# Altium schematic sheet Digital_Output_CPU.SchDoc: TTL IO Interface for External I/O
size Tabloid; Date: 03/13/2023; Engineer: Terry D. Schevker; Revision: 1,0; SheetNumber: 2; SheetTotal: 3
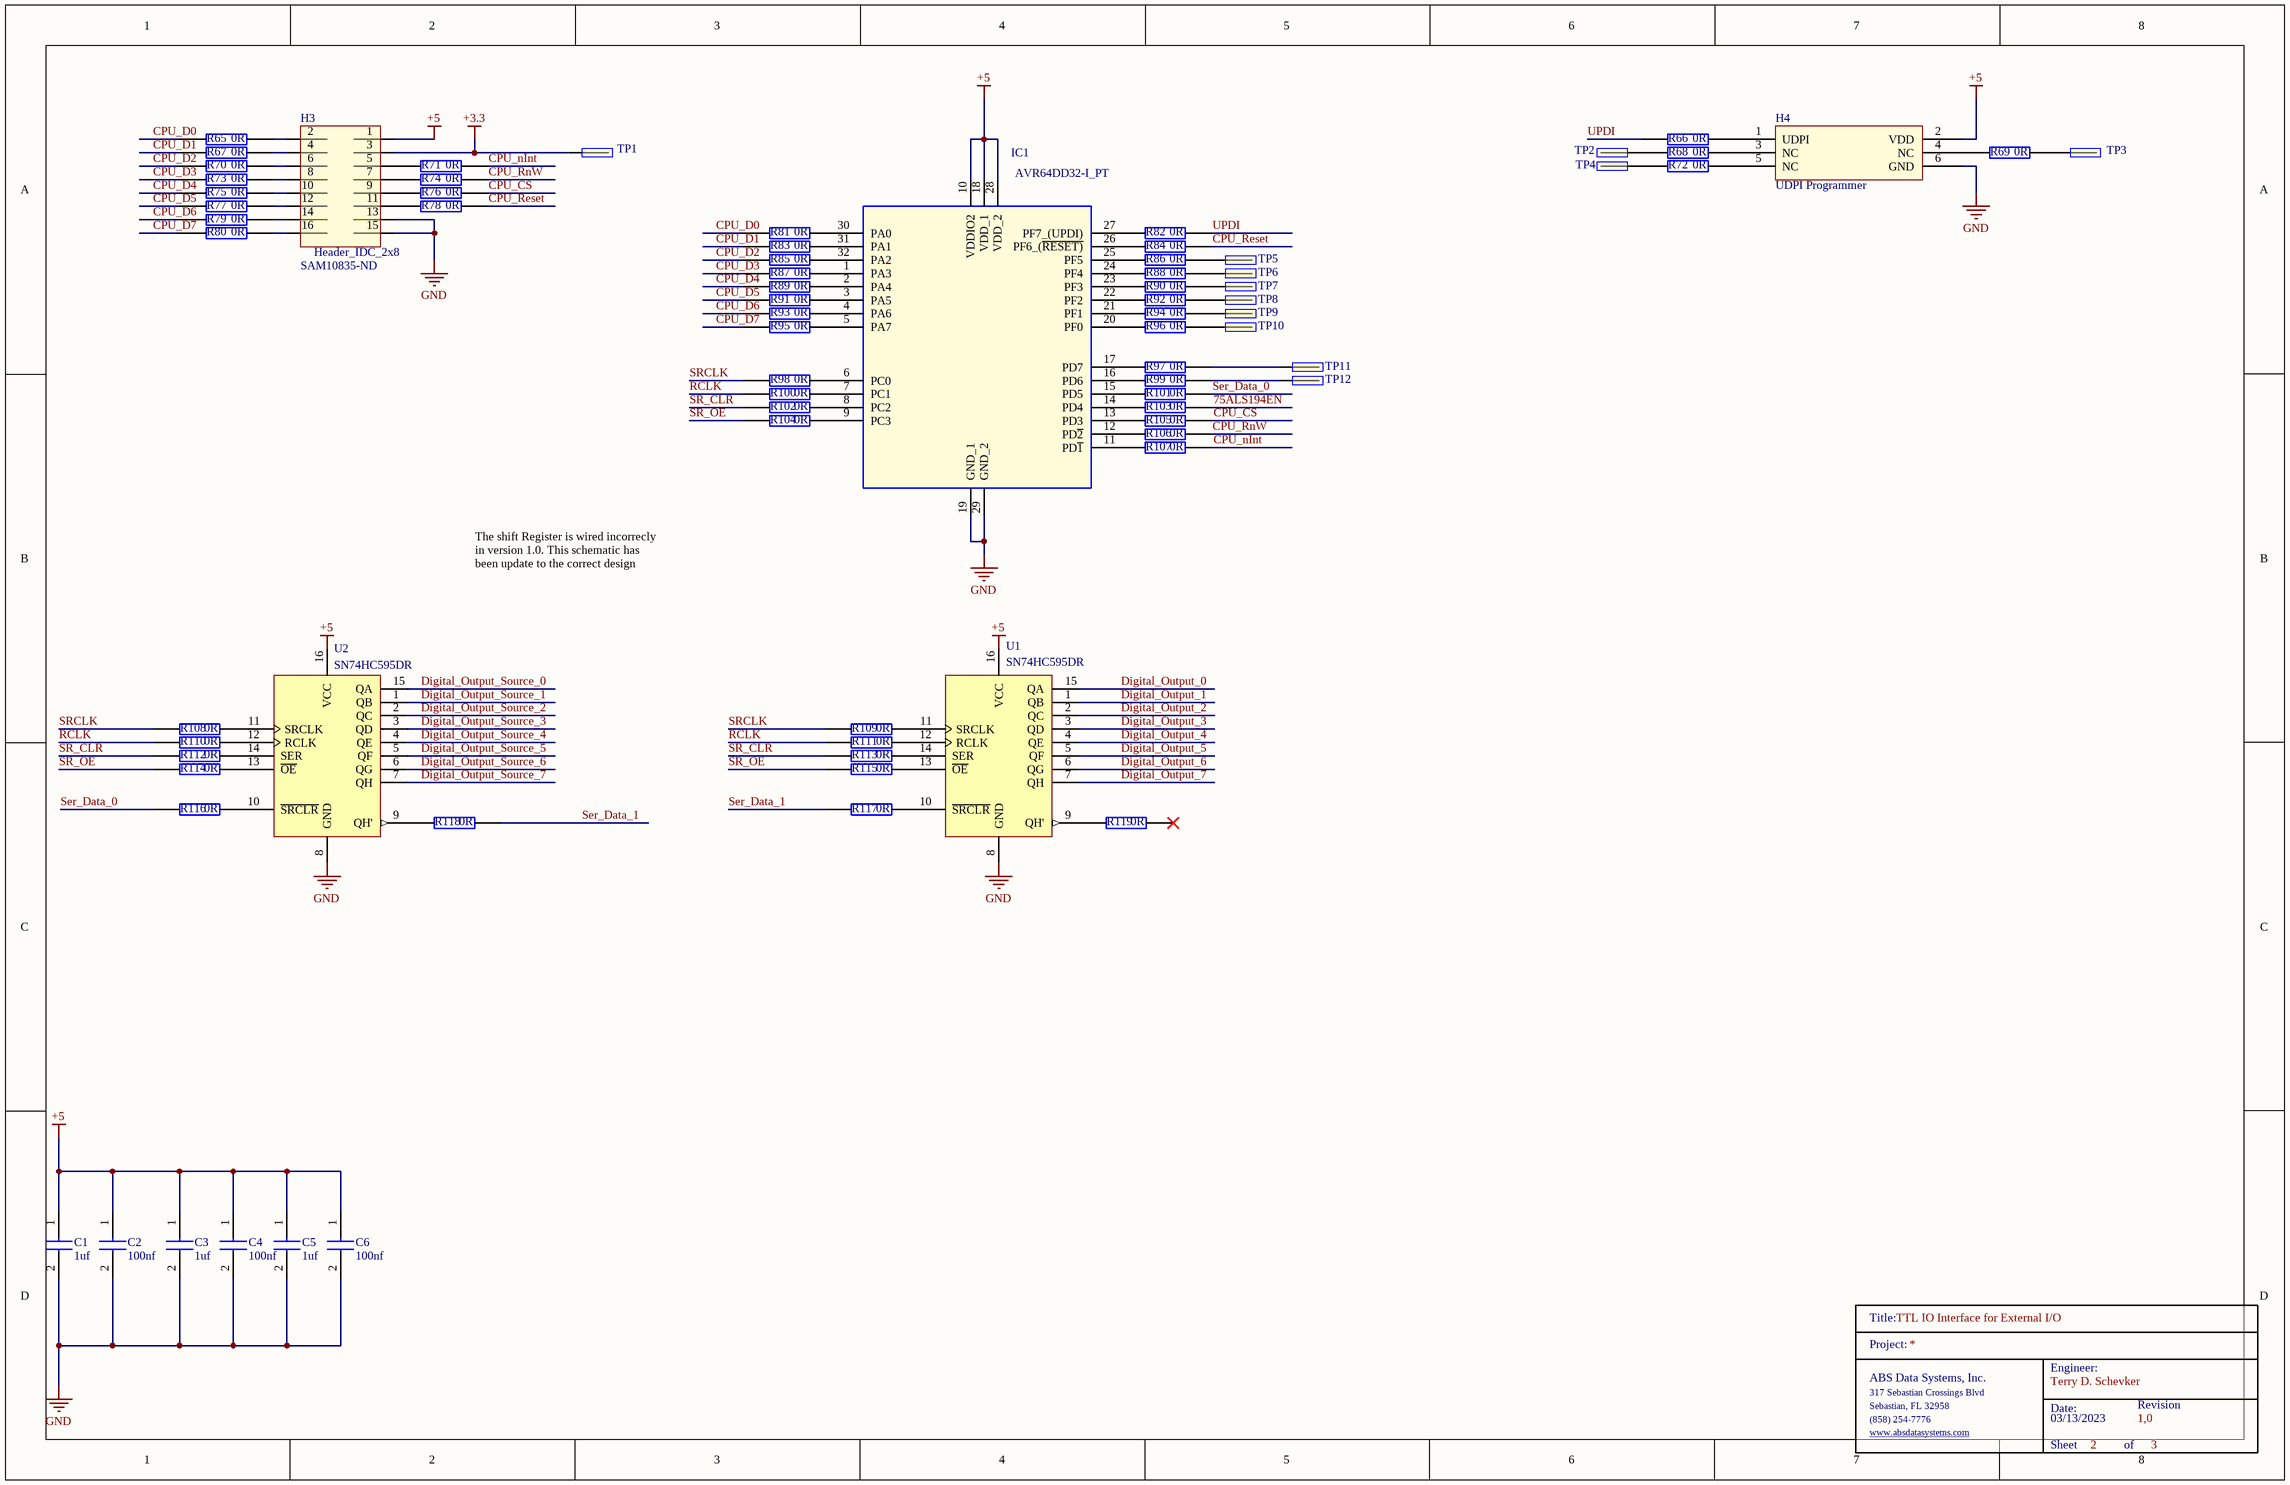
[diagram p0: Digital_Output_CPU.SchDoc]

## Parts
C1  1uf  [0603]
C2  100nf  [0603]
C3  1uf  [0603]
C4  100nf  [0603]
C5  1uf  [0603]
C6  100nf  [0603]
H3  Header_IDC_2x8  Supplier Part Number 1: SAM10835-ND  [HEADER16]
H4  UDPI Programmer  [HDR2X3]
IC1  AVR64DD32-I_PT  [QFP80P900X900X120-32N]
R65  0R  [0603]
R66  0R  [0603]
R67  0R  [0603]
R68  0R  [0603]
R69  0R  [0603]
R70  0R  [0603]
R71  0R  [0603]
R72  0R  [0603]
R73  0R  [0603]
R74  0R  [0603]
R75  0R  [0603]
R76  0R  [0603]
R77  0R  [0603]
R78  0R  [0603]
R79  0R  [0603]
R80  0R  [0603]
R81  0R  [0603]
R82  0R  [0603]
R83  0R  [0603]
R84  0R  [0603]
R85  0R  [0603]
R86  0R  [0603]
R87  0R  [0603]
R88  0R  [0603]
R89  0R  [0603]
R90  0R  [0603]
R91  0R  [0603]
R92  0R  [0603]
R93  0R  [0603]
R94  0R  [0603]
R95  0R  [0603]
R96  0R  [0603]
R97  0R  [0603]
R98  0R  [0603]
R99  0R  [0603]
R100  0R  [0603]
R101  0R  [0603]
R102  0R  [0603]
R103  0R  [0603]
R104  0R  [0603]
R105  0R  [0603]
R106  0R  [0603]
R107  0R  [0603]
R108  0R  [0603]
R109  0R  [0603]
R110  0R  [0603]
R111  0R  [0603]
R112  0R  [0603]
R113  0R  [0603]
R114  0R  [0603]
R115  0R  [0603]
R116  0R  [0603]
R117  0R  [0603]
R118  0R  [0603]
R119  0R  [0603]
TitleBlock_1  TitleBlock  (value not drawn)  (graphical)
TP1  TP  [TP]  (value not drawn)
TP2  TP  [TP]  (value not drawn)
TP3  TP  [TP]  (value not drawn)
TP4  TP  [TP]  (value not drawn)
TP5  TP  [TP]  (value not drawn)
TP6  TP  [TP]  (value not drawn)
TP7  TP  [TP]  (value not drawn)
TP8  TP  [TP]  (value not drawn)
TP9  TP  [TP]  (value not drawn)
TP10  TP  [TP]  (value not drawn)
TP11  TP  [TP]  (value not drawn)
TP12  TP  [TP]  (value not drawn)
U1  SN74HC595DR  [SOIC_16_Narrow]
U2  SN74HC595DR  [SOIC_16_Narrow]

## Nets
+3.3: H3.3 TP1.1
+5: C1.1 C2.1 C3.1 C4.1 C5.1 C6.1 H3.1 H4.2(VDD) IC1.10(VDDIO2) IC1.18(VDD_1) IC1.28(VDD_2) U1.16(VCC) U2.16(VCC)
GND: C1.2 C2.2 C3.2 C4.2 C5.2 C6.2 H3.13 H3.15 H4.6(GND) IC1.19(GND_1) IC1.29(GND_2) U1.8(GND) U2.8(GND)
75ALS194EN: R103.2
CPU_CS: R76.2 R105.2
CPU_D0: R65.1 R81.1
CPU_D1: R67.1 R83.1
CPU_D2: R70.1 R85.1
CPU_D3: R73.1 R87.1
CPU_D4: R75.1 R89.1
CPU_D5: R77.1 R91.1
CPU_D6: R79.1 R93.1
CPU_D7: R80.1 R95.1
CPU_nInt: R71.2 R107.2
CPU_Reset: R78.2 R84.2
CPU_RnW: R74.2 R106.2
Digital_Output_0: U1.15(QA)
Digital_Output_1: U1.1(QB)
Digital_Output_2: U1.2(QC)
Digital_Output_3: U1.3(QD)
Digital_Output_4: U1.4(QE)
Digital_Output_5: U1.5(QF)
Digital_Output_6: U1.6(QG)
Digital_Output_7: U1.7(QH)
Digital_Output_Source_0: U2.15(QA)
Digital_Output_Source_1: U2.1(QB)
Digital_Output_Source_2: U2.2(QC)
Digital_Output_Source_3: U2.3(QD)
Digital_Output_Source_4: U2.4(QE)
Digital_Output_Source_5: U2.5(QF)
Digital_Output_Source_6: U2.6(QG)
Digital_Output_Source_7: U2.7(QH)
RCLK: R100.1 R110.1 R111.1
Ser_Data_0: R101.2 R116.1
Ser_Data_1: R117.1 R118.2
SR_CLR: R102.1 R112.1 R113.1
SR_OE: R104.1 R114.1 R115.1
SRCLK: R98.1 R108.1 R109.1
UPDI: R66.1 R82.2
NetH3_2: H3.2 R65.2
NetH3_4: H3.4 R67.2
NetH3_5: H3.5 R71.1
NetH3_6: H3.6 R70.2
NetH3_7: H3.7 R74.1
NetH3_8: H3.8 R73.2
NetH3_9: H3.9 R76.1
NetH3_10: H3.10 R75.2
NetH3_11: H3.11 R78.1
NetH3_12: H3.12 R77.2
NetH3_14: H3.14 R79.2
NetH3_16: H3.16 R80.2
NetH4_1: H4.1(UDPI) R66.2
NetH4_3: H4.3(NC) R68.2
NetH4_4: H4.4(NC) R69.1
NetH4_5: H4.5(NC) R72.2
NetIC1_1: IC1.1(PA3) R87.2
NetIC1_2: IC1.2(PA4) R89.2
NetIC1_3: IC1.3(PA5) R91.2
NetIC1_4: IC1.4(PA6) R93.2
NetIC1_5: IC1.5(PA7) R95.2
NetIC1_6: IC1.6(PC0) R98.2
NetIC1_7: IC1.7(PC1) R100.2
NetIC1_8: IC1.8(PC2) R102.2
NetIC1_9: IC1.9(PC3) R104.2
NetIC1_11: IC1.11(PD~{1}) R107.1
NetIC1_12: IC1.12(PD~{2}) R106.1
NetIC1_13: IC1.13(PD3) R105.1
NetIC1_14: IC1.14(PD4) R103.1
NetIC1_15: IC1.15(PD5) R101.1
NetIC1_16: IC1.16(PD6) R99.1
NetIC1_17: IC1.17(PD7) R97.1
NetIC1_20: IC1.20(PF0) R96.1
NetIC1_21: IC1.21(PF1) R94.1
NetIC1_22: IC1.22(PF2) R92.1
NetIC1_23: IC1.23(PF3) R90.1
NetIC1_24: IC1.24(PF4) R88.1
NetIC1_25: IC1.25(PF5) R86.1
NetIC1_26: IC1.26(PF6_(~{RESET)}) R84.1
NetIC1_27: IC1.27(PF7_(UPDI)) R82.1
NetIC1_30: IC1.30(PA0) R81.2
NetIC1_31: IC1.31(PA1) R83.2
NetIC1_32: IC1.32(PA2) R85.2
NetR68_1: R68.1 TP2.1
NetR69_2: R69.2 TP3.1
NetR72_1: R72.1 TP4.1
NetR86_2: R86.2 TP5.1
NetR88_2: R88.2 TP6.1
NetR90_2: R90.2 TP7.1
NetR92_2: R92.2 TP8.1
NetR94_2: R94.2 TP9.1
NetR96_2: R96.2 TP10.1
NetR97_2: R97.2 TP11.1
NetR99_2: R99.2 TP12.1
NetR108_2: R108.2 U2.11(SRCLK)
NetR109_2: R109.2 U1.11(SRCLK)
NetR110_2: R110.2 U2.12(RCLK)
NetR111_2: R111.2 U1.12(RCLK)
NetR112_2: R112.2 U2.14(SER)
NetR113_2: R113.2 U1.14(SER)
NetR114_2: R114.2 U2.13(~{OE})
NetR115_2: R115.2 U1.13(~{OE})
NetR116_2: R116.2 U2.10(~{SRCLR})
NetR117_2: R117.2 U1.10(~{SRCLR})
NetR118_1: R118.1 U2.9(QH')
NetR119_1: R119.1 U1.9(QH')

Not connected (* = marked no-connect by the designer): R119 2*

## Notes on the sheet
- The shift Register is wired incorrecly in version 1.0. This schematic has been update to the correct design
- (in symbol TitleBlock) Title:; Project:; Engineer:; ABS Data Systems, Inc.; 317 Sebastian Crossings Blvd; Sebastian, FL 32958; Date:; Revision; (858) 254-7776; www.absdatasystems.com; Sheet; of

## Library data of the parts
C1 C3 C5 = CL10B105KA8NNNL: Samsung Electro-Mechanics 0603 1uf
C2 C4 C6 = CL10B104JB8NNNC: Samsung Electro-Mechanics 0603 100nf
H3 = Header_IDC_2x8: 16 Pin 2x8 Through Hold IDC Connector; Manufacturer: Samtec; Manufacturer Part Number: TST-108-01-G-D; Number of Contacts: 16; Gender: Male; Connector Type: Male Pin; Pitch: 2.54mm; Row Spacing: 0.1inch; Supplier 1: Digi-Key; RoHS: Yes; Category: Headers and Wire Housings; Stock 1: 227; Pricing 1: 1=2.85000, 10=2.73600, 100=2.28000, 500=1.93800, 1000=1.65300, 5000=1.48200 (USD); Mount: Through Hole; Contact Plating: Gold; Contact Material: Bronze; Housing Material: Polyester; Housing Color: Black; Color: Black; Min Operating Temperature: -55°C; Max Operating Temperature: 125°C; Number of Rows: 2; Termination: Solder; Packaging: Rail/Tube; Orientation: Straight; Number of Positions: 16; Length: 27.94mm; Depth: 9.27mm; Contact Mating Length: 0.25inch; REACH SVHC: No SVHC; ComponentLink1URL: https://datasheet.ciiva.com/739/tst-mkt-739845.pdf?src-supplier=Digi-Key; ComponentLink1Description: https://datasheet.ciiva.com/739/tst-mkt-739845.pdf?src-supplier=Digi-Key; ComponentLink2URL: https://datasheet.ciiva.com/10018/htst-10018510.pdf?src-supplier=Avnet; ComponentLink2Description: https://datasheet.ciiva.com/10018/htst-10018510.pdf?src-supplier=Avnet
H4 = UDPI Programmer: 6 Pin 2X3 Through Hole Header
IC1 = AVR64DD32-I_PT: Integrated Circuit; Manufacturer_Name: Microchip; Manufacturer_Part_Number: AVR64DD32-I/PT | MULTI-VOLTAGE I/O; Datasheet Link: https://www.microchip.com/en-us/product/AVR64DD32; Height: 1.2mm
R65-R119 = RC0603JR-070RL: YAGEO 0603 0 ohm; Manufacturer_Name: KEMET; Geometry.Height: 0.55mm; Mouser Part Number: 603-RC0603JR-070RL; Mouser Price/Stock: https://www.mouser.co.uk/ProductDetail/YAGEO/RC0603JR-070RL?qs=2cAdsCoAWRGWyPcuXgGiXQ%3D%3D; Manufacturer_Part_Number: RC0603JR-070RL; Datasheet Link: https://datasheet.datasheetarchive.com/originals/distributors/Datasheets_SAMA/902f9e387b938f871d31120f5fc1d65e.pdf
TP1-TP12 = TP: Manufacturer: Samtec; Manufacturer Part Number: TST-105-01-G-D; Number of Contacts: 16; Gender: Male; Connector Type: Male Pin; Pitch: 2.54mm; Row Spacing: 0.1inch; Supplier 1: Digi-Key; RoHS: Yes; Category: Headers and Wire Housings; Stock 1: 227; Pricing 1: 1=2.85000, 10=2.73600, 100=2.28000, 500=1.93800, 1000=1.65300, 5000=1.48200 (USD); Mount: Through Hole; Contact Plating: Gold; Contact Material: Bronze; Housing Material: Polyester; Housing Color: Black; Color: Black; Min Operating Temperature: -55°C; Max Operating Temperature: 125°C; Number of Rows: 2; Termination: Solder; Packaging: Rail/Tube; Orientation: Straight; Number of Positions: 16; Length: 27.94mm; Depth: 9.27mm; Contact Mating Length: 0.25inch; REACH SVHC: No SVHC; ComponentLink1URL: https://datasheet.ciiva.com/739/tst-mkt-739845.pdf?src-supplier=Digi-Key; ComponentLink1Description: https://datasheet.ciiva.com/739/tst-mkt-739845.pdf?src-supplier=Digi-Key; ComponentLink2URL: https://datasheet.ciiva.com/10018/htst-10018510.pdf?src-supplier=Avnet; ComponentLink2Description: https://datasheet.ciiva.com/10018/htst-10018510.pdf?src-supplier=Avnet
U1 U2 = SN74HC595DR: 8-Bit Shift Registers With 3-State Output Registers, D0016A, LARGE T&R; Manufacturer: Texas Instruments; Output Drive (IOL/IOH)(Max)(mA): 7.8/-7.8; Rating: Military; ICC @ Nom Voltage(Max)(mA): 0.08; VCC(Min)(V): 2; tpd @ Nom Voltage(Max)(ns): 34; 3-State Output: Yes; Output Type: CMOS; Voltage(Nom)(V): 6; F @ Nom Voltage(Max)(Mhz): 28; Technology Family: HC; Bits: 4; Max Supply Voltage: 6V; Min Supply Voltage: 2V; Propagation Delay: 250ns; Number of Elements: 1; Number of Output Lines: 10; Direction: Unidirectional; Number of Bits: 8; Quiescent Current: 8uA; Operating Supply Voltage: 5V; Frequency: 42MHz; Max Input Current: 1uA; PackageReference: D0016A; Code_JEDEC: MS-012 variation AC; Generic Part Number: SN74HC595; Operating Temperature Range(C): -40 to 85; DatasheetVersion: SCLS041H; PackageVersion: http://www.ti.com/lit/ml/mpds178g/mpds178g.pdf; Input Type: CMOS; VCC(Max)(V): 6; Supplier 1: Digi-Key; Supplier Part Number 1: 296-14857-1-ND; Manufacturer Part Number: SN74HC595DR; Stock 1: 38406; Pricing 1: 1=0.51000, 10=0.43300, 100=0.32300, 500=0.25380, 1000=0.19611 (USD); RoHS: Yes; Mount: Surface Mount; Case/Package: SOIC; Number of Pins: 16; Weight: 0.004998oz; Contact Plating: Gold; Min Operating Temperature: -40°C; Max Operating Temperature: 85°C; Packaging: Tape and Reel; Package Quantity: 2500; Logic Function: Shift Register; Number of Circuits: 4; Number of Bits per Element: 8; Turn-On Delay Time: 250ns; Termination: SMD/SMT; Length: 9.9mm; Height: 1.58mm; Width: 3.91mm; Radiation Hardening: No; REACH SVHC: No SVHC; Lead Free: Lead Free; ComponentLink1URL: https://datasheet.ciiva.com/15093/getdatasheetpartid-134875-15093436.pdf?src-supplier=Verical; ComponentLink1Description: https://datasheet.ciiva.com/15093/getdatasheetpartid-134875-15093436.pdf?src-supplier=Verical; ComponentLink2URL: https://datasheet.ciiva.com/22696/1831198-22696812.pdf?src-supplier=Element14; ComponentLink2Description: https://datasheet.ciiva.com/22696/1831198-22696812.pdf?src-supplier=Element14; ComponentLink3URL: https://datasheet.ciiva.com/34301/916385-34301758.pdf?src-supplier=Jameco; ComponentLink3Description: https://datasheet.ciiva.com/34301/916385-34301758.pdf?src-supplier=Jameco; ComponentLink4URL: https://datasheet.ciiva.com/26866/sn74hc595dr-26866161.pdf?src-supplier=IIIC; ComponentLink4Description: https://datasheet.ciiva.com/26866/sn74hc595dr-26866161.pdf?src-supplier=IIIC; ComponentLink5URL: https://datasheet.ciiva.com/1886/sn74hc595-1886279.pdf?src-supplier=Digi-Key; ComponentLink5Description: https://datasheet.ciiva.com/1886/sn74hc595-1886279.pdf?src-supplier=Digi-Key; ComponentLink6URL: https://datasheet.ciiva.com/1886/sn74hc595-1886280.pdf?src-supplier=Digi-Key; ComponentLink6Description: https://datasheet.ciiva.com/1886/sn74hc595-1886280.pdf?src-supplier=Digi-Key; ComponentLink7URL: https://datasheet.ciiva.com/1886/sn74hc595-1886281.pdf?src-supplier=Digi-Key; ComponentLink7Description: https://datasheet.ciiva.com/1886/sn74hc595-1886281.pdf?src-supplier=Digi-Key; ComponentLink8URL: https://datasheet.ciiva.com/1509/1831198-1509483.pdf?src-supplier=Element14; ComponentLink8Description: https://datasheet.ciiva.com/1509/1831198-1509483.pdf?src-supplier=Element14; ComponentLink9URL: https://datasheet.ciiva.com/46381/1886142-46381835.pdf?src-supplier=Element14; ComponentLink9Description: https://datasheet.ciiva.com/46381/1886142-46381835.pdf?src-supplier=Element14; ComponentLink10URL: https://datasheet.ciiva.com/14294/sn74hc595-14294989.pdf?src-supplier=Avnet; ComponentLink10Description: https://datasheet.ciiva.com/14294/sn74hc595-14294989.pdf?src-supplier=Avnet; ComponentLink11URL: https://datasheet.ciiva.com/14294/sn74hc595-14294991.pdf?src-supplier=Avnet; ComponentLink11Description: https://datasheet.ciiva.com/14294/sn74hc595-14294991.pdf?src-supplier=Avnet; ComponentLink12URL: https://datasheet.ciiva.com/46435/1831198-46435871.pdf?src-supplier=Element14; ComponentLink12Description: https://datasheet.ciiva.com/46435/1831198-46435871.pdf?src-supplier=Element14